# EAGLE design DigitMux (EAGLE 9.6.2)
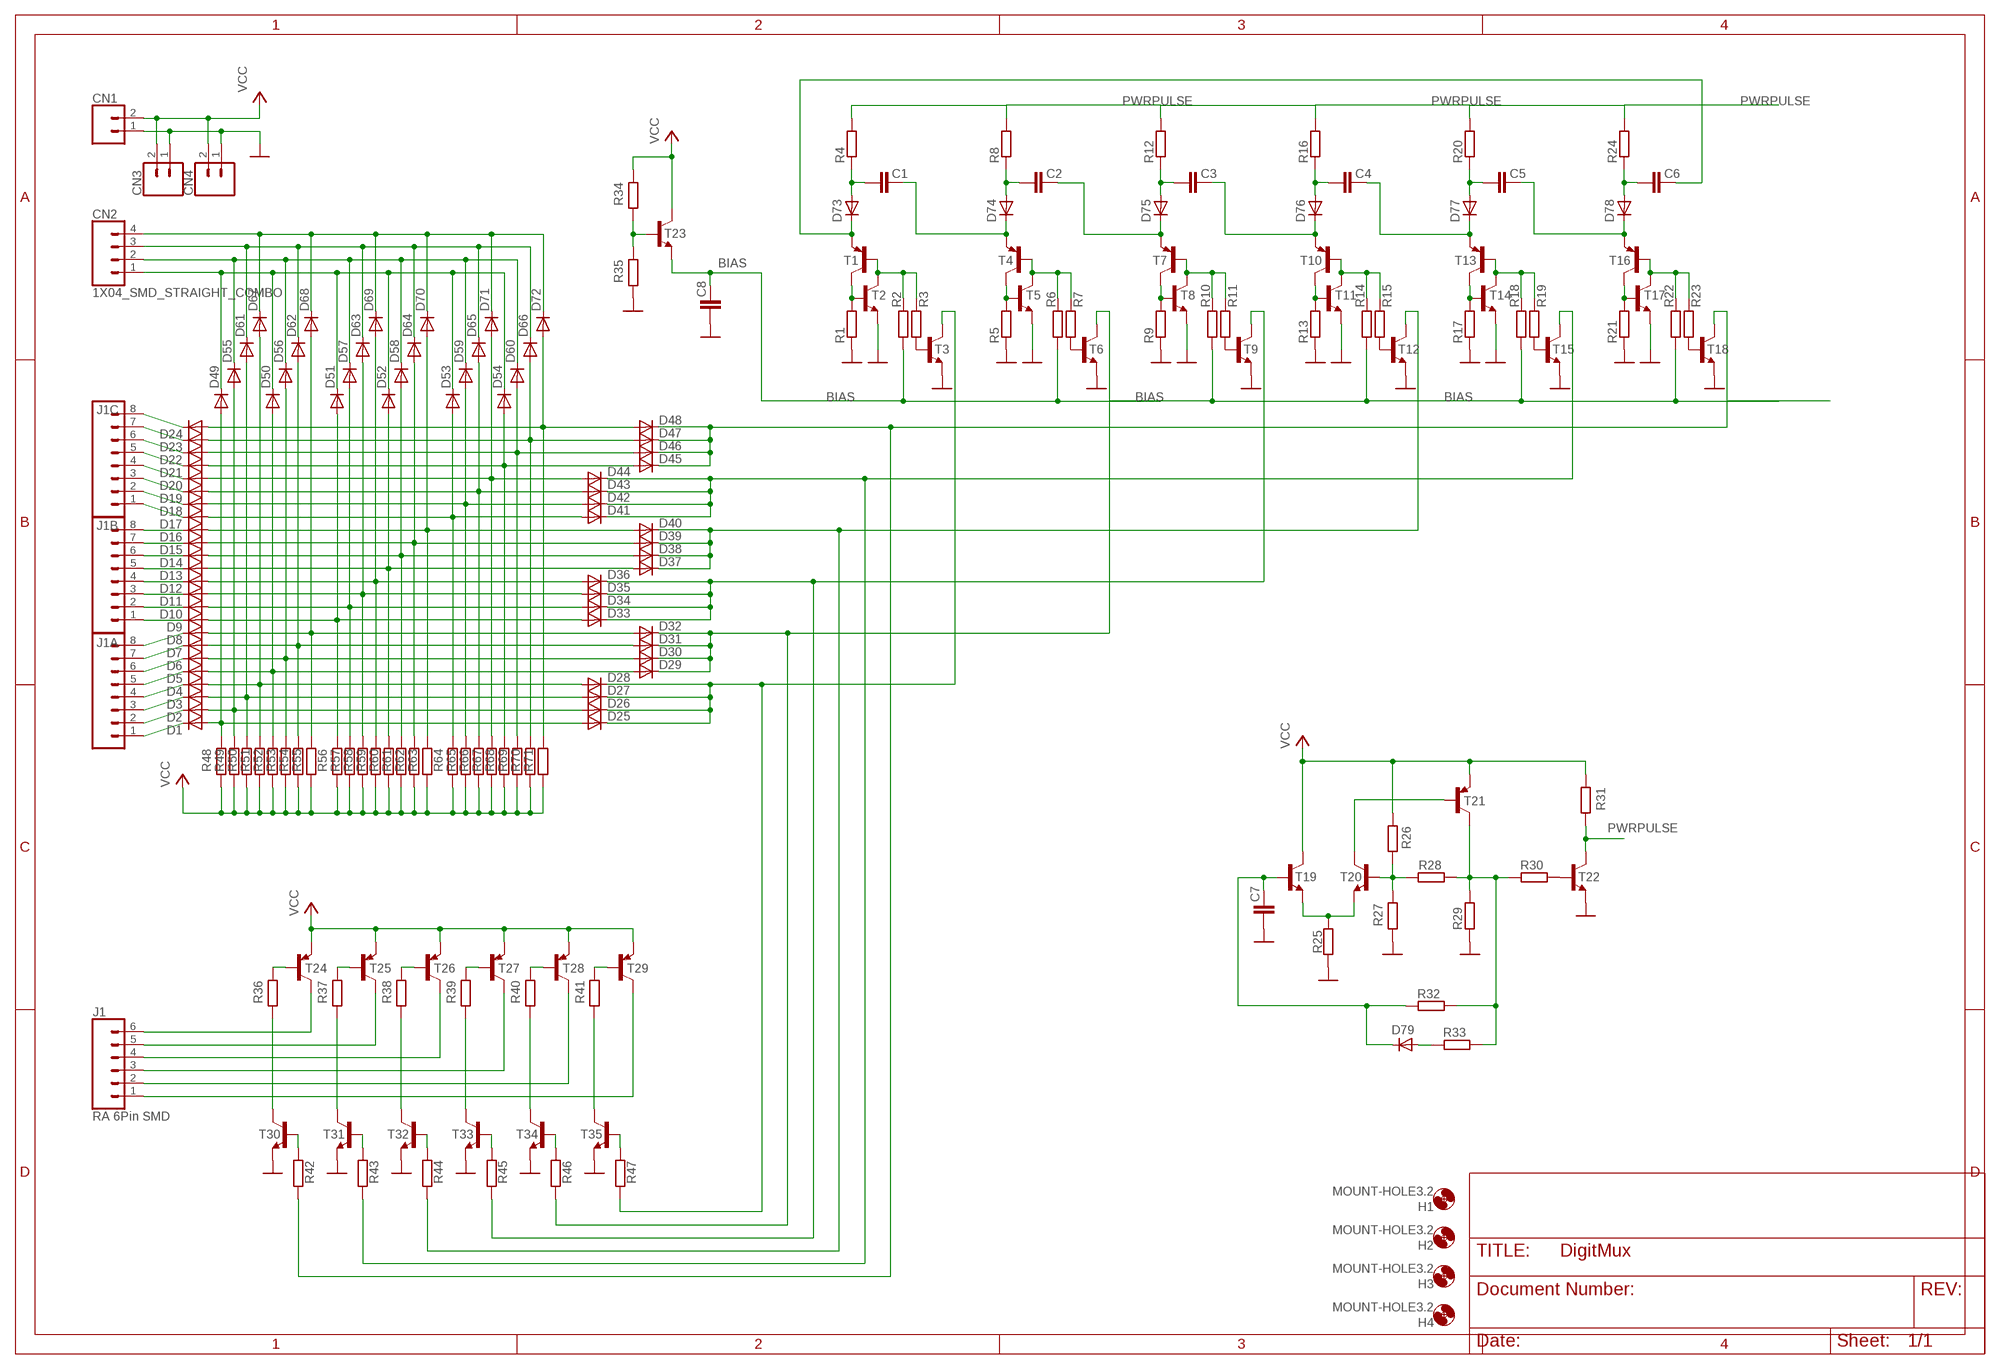
[diagram p0: schematic, sheet 1]

## Parts
C1  0.1uF  0.1UF-KIT-EZ-50V-20%  [CAP-PTH-SMALL-KIT]
C2  0.1uF  0.1UF-KIT-EZ-50V-20%  [CAP-PTH-SMALL-KIT]
C3  0.1uF  0.1UF-KIT-EZ-50V-20%  [CAP-PTH-SMALL-KIT]
C4  0.1uF  0.1UF-KIT-EZ-50V-20%  [CAP-PTH-SMALL-KIT]
C5  0.1uF  0.1UF-KIT-EZ-50V-20%  [CAP-PTH-SMALL-KIT]
C6  0.1uF  0.1UF-KIT-EZ-50V-20%  [CAP-PTH-SMALL-KIT]
C7  0.1uF  0.1UF-KIT-EZ-50V-20%  [CAP-PTH-SMALL-KIT]
C8  0.1uF  0.1UF-KIT-EZ-50V-20%  [CAP-PTH-SMALL-KIT]
CN1  CONN_02  [1X02]
CN2  1X04_SMD_STRAIGHT_COMBO  CONN_04  [1X04]
CN3  CONN_02  [1X02]
CN4  CONN_02  [1X02]
D1  SMALL_DIODEDO35-7  [DO35-7]
D2  SMALL_DIODEDO35-7  [DO35-7]
D3  SMALL_DIODEDO35-7  [DO35-7]
D4  SMALL_DIODEDO35-7  [DO35-7]
D5  SMALL_DIODEDO35-7  [DO35-7]
D6  SMALL_DIODEDO35-7  [DO35-7]
D7  SMALL_DIODEDO35-7  [DO35-7]
D8  SMALL_DIODEDO35-7  [DO35-7]
D9  SMALL_DIODEDO35-7  [DO35-7]
D10  SMALL_DIODEDO35-7  [DO35-7]
D11  SMALL_DIODEDO35-7  [DO35-7]
D12  SMALL_DIODEDO35-7  [DO35-7]
D13  SMALL_DIODEDO35-7  [DO35-7]
D14  SMALL_DIODEDO35-7  [DO35-7]
D15  SMALL_DIODEDO35-7  [DO35-7]
D16  SMALL_DIODEDO35-7  [DO35-7]
D17  SMALL_DIODEDO35-7  [DO35-7]
D18  SMALL_DIODEDO35-7  [DO35-7]
D19  SMALL_DIODEDO35-7  [DO35-7]
D20  SMALL_DIODEDO35-7  [DO35-7]
D21  SMALL_DIODEDO35-7  [DO35-7]
D22  SMALL_DIODEDO35-7  [DO35-7]
D23  SMALL_DIODEDO35-7  [DO35-7]
D24  SMALL_DIODEDO35-7  [DO35-7]
D25  SMALL_DIODEDO35-7  [DO35-7]
D26  SMALL_DIODEDO35-7  [DO35-7]
D27  SMALL_DIODEDO35-7  [DO35-7]
D28  SMALL_DIODEDO35-7  [DO35-7]
D29  SMALL_DIODEDO35-7  [DO35-7]
D30  SMALL_DIODEDO35-7  [DO35-7]
D31  SMALL_DIODEDO35-7  [DO35-7]
D32  SMALL_DIODEDO35-7  [DO35-7]
D33  SMALL_DIODEDO35-7  [DO35-7]
D34  SMALL_DIODEDO35-7  [DO35-7]
D35  SMALL_DIODEDO35-7  [DO35-7]
D36  SMALL_DIODEDO35-7  [DO35-7]
D37  SMALL_DIODEDO35-7  [DO35-7]
D38  SMALL_DIODEDO35-7  [DO35-7]
D39  SMALL_DIODEDO35-7  [DO35-7]
D40  SMALL_DIODEDO35-7  [DO35-7]
D41  SMALL_DIODEDO35-7  [DO35-7]
D42  SMALL_DIODEDO35-7  [DO35-7]
D43  SMALL_DIODEDO35-7  [DO35-7]
D44  SMALL_DIODEDO35-7  [DO35-7]
D45  SMALL_DIODEDO35-7  [DO35-7]
D46  SMALL_DIODEDO35-7  [DO35-7]
D47  SMALL_DIODEDO35-7  [DO35-7]
D48  SMALL_DIODEDO35-7  [DO35-7]
D49  SMALL_DIODEDO35-7  [DO35-7]
D50  SMALL_DIODEDO35-7  [DO35-7]
D51  SMALL_DIODEDO35-7  [DO35-7]
D52  SMALL_DIODEDO35-7  [DO35-7]
D53  SMALL_DIODEDO35-7  [DO35-7]
D54  SMALL_DIODEDO35-7  [DO35-7]
D55  SMALL_DIODEDO35-7  [DO35-7]
D56  SMALL_DIODEDO35-7  [DO35-7]
D57  SMALL_DIODEDO35-7  [DO35-7]
D58  SMALL_DIODEDO35-7  [DO35-7]
D59  SMALL_DIODEDO35-7  [DO35-7]
D60  SMALL_DIODEDO35-7  [DO35-7]
D61  SMALL_DIODEDO35-7  [DO35-7]
D62  SMALL_DIODEDO35-7  [DO35-7]
D63  SMALL_DIODEDO35-7  [DO35-7]
D64  SMALL_DIODEDO35-7  [DO35-7]
D65  SMALL_DIODEDO35-7  [DO35-7]
D66  SMALL_DIODEDO35-7  [DO35-7]
D67  SMALL_DIODEDO35-7  [DO35-7]
D68  SMALL_DIODEDO35-7  [DO35-7]
D69  SMALL_DIODEDO35-7  [DO35-7]
D70  SMALL_DIODEDO35-7  [DO35-7]
D71  SMALL_DIODEDO35-7  [DO35-7]
D72  SMALL_DIODEDO35-7  [DO35-7]
D73  SMALL_DIODEDO35-7  [DO35-7]
D74  SMALL_DIODEDO35-7  [DO35-7]
D75  SMALL_DIODEDO35-7  [DO35-7]
D76  SMALL_DIODEDO35-7  [DO35-7]
D77  SMALL_DIODEDO35-7  [DO35-7]
D78  SMALL_DIODEDO35-7  [DO35-7]
D79  SMALL_DIODEDO35-7  [DO35-7]
H1  MOUNT-HOLE3.2  [3,2]
H2  MOUNT-HOLE3.2  [3,2]
H3  MOUNT-HOLE3.2  [3,2]
H4  MOUNT-HOLE3.2  [3,2]
J1  RA 6Pin SMD  CONN_06SILK_FEMALE_PTH  [1X06]
J1A  CONN_08"  [1X08]
J1B  CONN_08"  [1X08]
J1C  CONN_08"  [1X08]
R1  RESISTOR7MM  [7MM_RESISTOR]
R2  RESISTOR7MM  [7MM_RESISTOR]
R3  RESISTOR7MM  [7MM_RESISTOR]
R4  RESISTOR7MM  [7MM_RESISTOR]
R5  RESISTOR7MM  [7MM_RESISTOR]
R6  RESISTOR7MM  [7MM_RESISTOR]
R7  RESISTOR7MM  [7MM_RESISTOR]
R8  RESISTOR7MM  [7MM_RESISTOR]
R9  RESISTOR7MM  [7MM_RESISTOR]
R10  RESISTOR7MM  [7MM_RESISTOR]
R11  RESISTOR7MM  [7MM_RESISTOR]
R12  RESISTOR7MM  [7MM_RESISTOR]
R13  RESISTOR7MM  [7MM_RESISTOR]
R14  RESISTOR7MM  [7MM_RESISTOR]
R15  RESISTOR7MM  [7MM_RESISTOR]
R16  RESISTOR7MM  [7MM_RESISTOR]
R17  RESISTOR7MM  [7MM_RESISTOR]
R18  RESISTOR7MM  [7MM_RESISTOR]
R19  RESISTOR7MM  [7MM_RESISTOR]
R20  RESISTOR7MM  [7MM_RESISTOR]
R21  RESISTOR7MM  [7MM_RESISTOR]
R22  RESISTOR7MM  [7MM_RESISTOR]
R23  RESISTOR7MM  [7MM_RESISTOR]
R24  RESISTOR7MM  [7MM_RESISTOR]
R25  RESISTOR7MM  [7MM_RESISTOR]
R26  RESISTOR7MM  [7MM_RESISTOR]
R27  RESISTOR7MM  [7MM_RESISTOR]
R28  RESISTOR7MM  [7MM_RESISTOR]
R29  RESISTOR7MM  [7MM_RESISTOR]
R30  RESISTOR7MM  [7MM_RESISTOR]
R31  RESISTOR7MM  [7MM_RESISTOR]
R32  RESISTOR7MM  [7MM_RESISTOR]
R33  RESISTOR7MM  [7MM_RESISTOR]
R34  RESISTOR7MM  [7MM_RESISTOR]
R35  RESISTOR7MM  [7MM_RESISTOR]
R36  RESISTOR7MM  [7MM_RESISTOR]
R37  RESISTOR7MM  [7MM_RESISTOR]
R38  RESISTOR7MM  [7MM_RESISTOR]
R39  RESISTOR7MM  [7MM_RESISTOR]
R40  RESISTOR7MM  [7MM_RESISTOR]
R41  RESISTOR7MM  [7MM_RESISTOR]
R42  RESISTOR7MM  [7MM_RESISTOR]
R43  RESISTOR7MM  [7MM_RESISTOR]
R44  RESISTOR7MM  [7MM_RESISTOR]
R45  RESISTOR7MM  [7MM_RESISTOR]
R46  RESISTOR7MM  [7MM_RESISTOR]
R47  RESISTOR7MM  [7MM_RESISTOR]
R48  RESISTOR7MM  [7MM_RESISTOR]
R49  RESISTOR7MM  [7MM_RESISTOR]
R50  RESISTOR7MM  [7MM_RESISTOR]
R51  RESISTOR7MM  [7MM_RESISTOR]
R52  RESISTOR7MM  [7MM_RESISTOR]
R53  RESISTOR7MM  [7MM_RESISTOR]
R54  RESISTOR7MM  [7MM_RESISTOR]
R55  RESISTOR7MM  [7MM_RESISTOR]
R56  RESISTOR7MM  [7MM_RESISTOR]
R57  RESISTOR7MM  [7MM_RESISTOR]
R58  RESISTOR7MM  [7MM_RESISTOR]
R59  RESISTOR7MM  [7MM_RESISTOR]
R60  RESISTOR7MM  [7MM_RESISTOR]
R61  RESISTOR7MM  [7MM_RESISTOR]
R62  RESISTOR7MM  [7MM_RESISTOR]
R63  RESISTOR7MM  [7MM_RESISTOR]
R64  RESISTOR7MM  [7MM_RESISTOR]
R65  RESISTOR7MM  [7MM_RESISTOR]
R66  RESISTOR7MM  [7MM_RESISTOR]
R67  RESISTOR7MM  [7MM_RESISTOR]
R68  RESISTOR7MM  [7MM_RESISTOR]
R69  RESISTOR7MM  [7MM_RESISTOR]
R70  RESISTOR7MM  [7MM_RESISTOR]
R71  RESISTOR7MM  [7MM_RESISTOR]
T1  BC557B-PNP-TO92-EBC  [TO92-EBC]
T2  BC547B-NPN-TO92-CBE  [TO92-CBE]
T3  BC547B-NPN-TO92-CBE  [TO92-CBE]
T4  BC557B-PNP-TO92-EBC  [TO92-EBC]
T5  BC547B-NPN-TO92-CBE  [TO92-CBE]
T6  BC547B-NPN-TO92-CBE  [TO92-CBE]
T7  BC557B-PNP-TO92-EBC  [TO92-EBC]
T8  BC547B-NPN-TO92-CBE  [TO92-CBE]
T9  BC547B-NPN-TO92-CBE  [TO92-CBE]
T10  BC557B-PNP-TO92-EBC  [TO92-EBC]
T11  BC547B-NPN-TO92-CBE  [TO92-CBE]
T12  BC547B-NPN-TO92-CBE  [TO92-CBE]
T13  BC557B-PNP-TO92-EBC  [TO92-EBC]
T14  BC547B-NPN-TO92-CBE  [TO92-CBE]
T15  BC547B-NPN-TO92-CBE  [TO92-CBE]
T16  BC557B-PNP-TO92-EBC  [TO92-EBC]
T17  BC547B-NPN-TO92-CBE  [TO92-CBE]
T18  BC547B-NPN-TO92-CBE  [TO92-CBE]
T19  BC547B-NPN-TO92-CBE  [TO92-CBE]
T20  BC547B-NPN-TO92-CBE  [TO92-CBE]
T21  BC557B-PNP-TO92-EBC  [TO92-EBC]
T22  BC547B-NPN-TO92-CBE  [TO92-CBE]
T23  BC547B-NPN-TO92-CBE  [TO92-CBE]
T24  BC557B-PNP-TO92-EBC  [TO92-EBC]
T25  BC557B-PNP-TO92-EBC  [TO92-EBC]
T26  BC557B-PNP-TO92-EBC  [TO92-EBC]
T27  BC557B-PNP-TO92-EBC  [TO92-EBC]
T28  BC557B-PNP-TO92-EBC  [TO92-EBC]
T29  BC557B-PNP-TO92-EBC  [TO92-EBC]
T30  BC547B-NPN-TO92-CBE  [TO92-CBE]
T31  BC547B-NPN-TO92-CBE  [TO92-CBE]
T32  BC547B-NPN-TO92-CBE  [TO92-CBE]
T33  BC547B-NPN-TO92-CBE  [TO92-CBE]
T34  BC547B-NPN-TO92-CBE  [TO92-CBE]
T35  BC547B-NPN-TO92-CBE  [TO92-CBE]

## Nets
BIAS: C8.2 R2.1 R6.1 R10.1 R14.1 R18.1 R22.1 T23.E
GND [PWR]: C7.1 C8.1 CN1.1 CN3.1 CN4.1 R1.1 R5.1 R9.1 R13.1 R17.1 R21.1 R25.1 R27.1 R29.2 R35.1 T2.E T3.E T5.E T6.E T8.E T9.E T11.E T12.E T14.E T15.E T17.E T18.E T22.E T30.E T31.E T32.E T33.E T34.E T35.E
N$1: R3.1 T3.B
N$2: D1.C J1A.1
N$3: R1.2 T1.C T2.B
N$4: C6.2 D73.C T1.E
N$5: D37.C D38.C D39.C D40.C R44.1 T12.C
N$6: D2.C J1A.2
N$7: D3.C J1A.3
N$8: D4.C J1A.4
N$9: D5.C J1A.5
N$10: D6.C J1A.6
N$11: D7.C J1A.7
N$12: D8.C J1A.8
N$13: D9.C J1B.1
N$14: D10.C J1B.2
N$15: D11.C J1B.3
N$16: D12.C J1B.4
N$17: D13.C J1B.5
N$18: D14.C J1B.6
N$19: D15.C J1B.7
N$20: D16.C J1B.8
N$21: D17.C J1C.1
N$22: D18.C J1C.2
N$23: D19.C J1C.3
N$24: D20.C J1C.4
N$25: D21.C J1C.5
N$26: D22.C J1C.6
N$27: D23.C J1C.7
N$28: D24.C J1C.8
N$29: D1.A D25.A D49.A R48.2
N$30: D17.A D41.A D53.A R64.2
N$31: D2.A D26.A D55.A R49.2
N$32: D3.A D27.A D61.A R50.2
N$33: D4.A D28.A D67.A R51.2
N$34: D5.A D29.A D50.A R52.2
N$35: D6.A D30.A D56.A R53.2
N$36: D7.A D31.A D62.A R54.2
N$37: D8.A D32.A D68.A R55.2
N$38: D9.A D33.A D51.A R56.2
N$39: D10.A D34.A D57.A R57.2
N$40: D11.A D35.A D63.A R58.2
N$41: D12.A D36.A D69.A R59.2
N$42: D13.A D37.A D52.A R60.2
N$43: D14.A D38.A D58.A R61.2
N$44: D15.A D39.A D64.A R62.2
N$45: D16.A D40.A D70.A R63.2
N$46: D18.A D42.A D59.A R65.2
N$47: D19.A D43.A D65.A R66.2
N$48: D20.A D44.A D71.A R67.2
N$49: D21.A D45.A D54.A R68.2
N$50: D22.A D46.A D60.A R69.2
N$51: D23.A D47.A D66.A R70.2
N$52: D24.A D48.A D72.A R71.2
N$53: R34.1 R35.2 T23.B
N$54: R28.1 R29.1 R30.2 R32.1 R33.1 T21.C
N$55: R11.1 T9.B
N$56: D33.C D34.C D35.C D36.C R45.1 T9.C
N$57: T20.C T21.B
N$58: D41.C D42.C D43.C D44.C R43.1 T15.C
N$59: R2.2 R3.2 T1.B T2.C
N$60: CN2.1 D49.C D50.C D51.C D52.C D53.C D54.C
N$61: CN2.2 D55.C D56.C D57.C D58.C D59.C D60.C
N$62: CN2.3 D61.C D62.C D63.C D64.C D65.C D66.C
N$63: CN2.4 D67.C D68.C D69.C D70.C D71.C D72.C
N$64: C1.1 D73.A R4.1
N$65: R7.1 T6.B
N$66: R5.2 T4.C T5.B
N$67: C1.2 D74.C T4.E
N$68: R25.2 T19.E T20.E
N$69: R9.2 T7.C T8.B
N$70: C2.1 D74.A R8.1
N$71: C2.2 D75.C T7.E
N$72: R19.1 T15.B
N$73: R6.2 R7.2 T4.B T5.C
N$74: C3.1 D75.A R12.1
N$75: R15.1 T12.B
N$76: R13.2 T10.C T11.B
N$77: R17.2 T13.C T14.B
N$78: R26.1 R27.2 R28.2 T20.B
N$79: C4.1 D76.A R16.1
N$80: C4.2 D77.C T13.E
N$81: C3.2 D76.C T10.E
N$82: R10.2 R11.2 T7.B T8.C
N$83: R30.1 T22.B
N$84: C5.1 D77.A R20.1
N$85: R23.1 T18.B
N$86: R21.2 T16.C T17.B
N$87: C5.2 D78.C T16.E
N$88: J1.6 T24.C
N$89: C6.1 D78.A R24.1
N$90: D79.A R33.2
N$91: C7.2 D79.C R32.2 T19.B
N$92: J1.5 T25.C
N$93: J1.4 T26.C
N$94: J1.3 T27.C
N$95: J1.2 T28.C
N$96: J1.1 T29.C
N$97: R36.2 T24.B
N$98: R37.2 T25.B
N$99: R38.2 T26.B
N$100: R39.2 T27.B
N$101: R40.2 T28.B
N$102: R41.2 T29.B
N$103: R36.1 T30.C
N$104: R37.1 T31.C
N$105: R38.1 T32.C
N$106: R39.1 T33.C
N$107: R40.1 T34.C
N$108: R41.1 T35.C
N$109: D45.C D46.C D47.C D48.C R42.1 T18.C
N$110: R42.2 T30.B
N$111: R14.2 R15.2 T10.B T11.C
N$112: R43.2 T31.B
N$113: R18.2 R19.2 T13.B T14.C
N$114: R44.2 T32.B
N$115: R22.2 R23.2 T16.B T17.C
N$116: R45.2 T33.B
N$117: D29.C D30.C D31.C D32.C R46.1 T6.C
N$118: R46.2 T34.B
N$119: D25.C D26.C D27.C D28.C R47.1 T3.C
N$120: R47.2 T35.B
PWRPULSE: R4.2 R8.2 R12.2 R16.2 R20.2 R24.2 R31.1 T22.C
VCC [PWR]: CN1.2 CN3.2 CN4.2 R26.2 R31.2 R34.2 R48.1 R49.1 R50.1 R51.1 R52.1 R53.1 R54.1 R55.1 R56.1 R57.1 R58.1 R59.1 R60.1 R61.1 R62.1 R63.1 R64.1 R65.1 R66.1 R67.1 R68.1 R69.1 R70.1 R71.1 T19.C T21.E T23.C T24.E T25.E T26.E T27.E T28.E T29.E

## Library data of the parts
C1-C8 = MatsEng:0.1UF: 0.1µF ceramic capacitors A capacitor is a passive two-terminal electrical component used to store electrical energy temporarily in an electric field.; PROD_ID: CAP-08370
CN1 CN3 CN4 = MatsEng:CONN_02: Multi connection point. Often used as Generic Header-pin footprint for 0.1 inch spaced/style header connections On any of the 0.1 inch spaced packages, you can populate with these: Break Away Headers - Straight <https://www.sparkfun.com/products/116> (PRT-00116) Break Away Male Headers - Right Angle <https://www.sparkfun.com/products/553> (PRT-00553) Female Headers <https://www.sparkfun.com/products/115> (PRT-00115) Break Away Headers - Machine Pin <https://www.sparkfun.com/products/117> (PRT-00117) Break Away Female Headers - Swiss Machine Pin <https://www.sparkfun.com/products/743> (PRT-00743) For SCREWTERMINALS and SPRING TERMINALS visit here: Screw Terimnals on SparkFun.com <https://www.sparkfun.com/search/results?term=Screw+Terminals> (5mm/3.5mm/2.54mm spacing) This device is also useful as a general connection point to wire up your design to another part of your project. Our various solder wires solder well into these plated through hole pads. Hook-Up Wire - Assortment (Stranded, 22 AWG) <https://www.sparkfun.com/products/11375> (PRT-11375) Hook-Up Wire - Assortment (Solid Core, 22 AWG) <https://www.sparkfun.com/products/11367> (PRT-11367) View the entire wire category on our website here <https://www.sparkfun.com/categories/141> Special notes: Molex polarized connector foot print use with: PRT-08233 with associated crimp pins and housings. 2.54_SCREWTERM for use with PRT-10571. 3.5mm Screw Terminal footprints for PRT-08084 5mm Screw Terminal footprints for use with PRT-08432; PROD_ID: CONN-13512; SF_ID: PRT-09918; SF_SKU: PRT-08432; SKU: PRT-09914
CN2 = MatsEng:CONN_04: Multi connection point. Often used as Generic Header-pin footprint for 0.1 inch spaced/style header connections On any of the 0.1 inch spaced packages, you can populate with these: Break Away Headers - Straight <https://www.sparkfun.com/products/116> (PRT-00116) Break Away Male Headers - Right Angle <https://www.sparkfun.com/products/553> (PRT-00553) Female Headers <https://www.sparkfun.com/products/115> (PRT-00115) Break Away Headers - Machine Pin <https://www.sparkfun.com/products/117> (PRT-00117) Break Away Female Headers - Swiss Machine Pin <https://www.sparkfun.com/products/743> (PRT-00743) For SCREWTERMINALS and SPRING TERMINALS visit here: Screw Terimnals on SparkFun.com <https://www.sparkfun.com/search/results?term=Screw+Terminals> (5mm/3.5mm/2.54mm spacing) This device is also useful as a general connection point to wire up your design to another part of your project. Our various solder wires solder well into these plated through hole pads. Hook-Up Wire - Assortment (Stranded, 22 AWG) <https://www.sparkfun.com/products/11375> (PRT-11375) Hook-Up Wire - Assortment (Solid Core, 22 AWG) <https://www.sparkfun.com/products/11367> (PRT-11367) View the entire wire category on our website here <https://www.sparkfun.com/categories/141> Special notes: Molex polarized connector foot print use with SKU : PRT-08231 with associated crimp pins and housings. 1MM SMD Version SKU: PRT-10208; PROD_ID: CONN-08511; SF_ID: PRT-12638
D1-D79 = MatsEng:SMALL_DIODE: Small Signal Diode
H1-H4 = MatsEng:MOUNT-HOLE: MOUNTING HOLE with drill center marker
J1 = MatsEng:CONN_06: Multi connection point. Often used as Generic Header-pin footprint for 0.1 inch spaced/style header connections On any of the 0.1 inch spaced packages, you can populate with these: Break Away Headers - Straight <https://www.sparkfun.com/products/116> (PRT-00116) Break Away Male Headers - Right Angle <https://www.sparkfun.com/products/553> (PRT-00553) Female Headers <https://www.sparkfun.com/products/115> (PRT-00115) Break Away Headers - Machine Pin <https://www.sparkfun.com/products/117> (PRT-00117) Break Away Female Headers - Swiss Machine Pin <https://www.sparkfun.com/products/743> (PRT-00743) Arduino Stackable Header - 6 Pin <https://www.sparkfun.com/products/9280> (PRT-09280) For SCREWTERMINALS and SPRING TERMINALS visit here: Screw Terimnals on SparkFun.com <https://www.sparkfun.com/search/results?term=Screw+Terminals> (5mm/3.5mm/2.54mm spacing) This device is also useful as a general connection point to wire up your design to another part of your project. Our various solder wires solder well into these plated through hole pads. Hook-Up Wire - Assortment (Stranded, 22 AWG) <https://www.sparkfun.com/products/11375> (PRT-11375) Hook-Up Wire - Assortment (Solid Core, 22 AWG) <https://www.sparkfun.com/products/11367> (PRT-11367) View the entire wire category on our website here <https://www.sparkfun.com/categories/141>; PROD_ID: CONN-11293; SF_ID: GPS-00579
J1A J1B J1C = MatsEng:CONN_08: Multi connection point. Often used as Generic Header-pin footprint for 0.1 inch spaced/style header connections On any of the 0.1 inch spaced packages, you can populate with these: Break Away Headers - Straight <https://www.sparkfun.com/products/116> (PRT-00116) Break Away Male Headers - Right Angle <https://www.sparkfun.com/products/553> (PRT-00553) Female Headers <https://www.sparkfun.com/products/115> (PRT-00115) Break Away Headers - Machine Pin <https://www.sparkfun.com/products/117> (PRT-00117) Break Away Female Headers - Swiss Machine Pin <https://www.sparkfun.com/products/743> (PRT-00743) Arduino Stackable Header - 8 Pin <https://www.sparkfun.com/products/9279> (PRT-09279) For SCREWTERMINALS and SPRING TERMINALS visit here: Screw Terimnals on SparkFun.com <https://www.sparkfun.com/search/results?term=Screw+Terminals> (5mm/3.5mm/2.54mm spacing) This device is also useful as a general connection point to wire up your design to another part of your project. Our various solder wires solder well into these plated through hole pads. Hook-Up Wire - Assortment (Stranded, 22 AWG) <https://www.sparkfun.com/products/11375> (PRT-11375) Hook-Up Wire - Assortment (Solid Core, 22 AWG) <https://www.sparkfun.com/products/11367> (PRT-11367) View the entire wire category on our website here <https://www.sparkfun.com/categories/141> Special notes: Molex polarized connector foot print use with SKU : PRT-08231 with associated crimp pins and housings. 1MM SMD Version SKU: PRT-10208 NOTES ON THE VARIANTS LOCK and LOCK_LONGPADS... This footprint was designed to help hold the alignment of a through-hole component (i.e. 6-pin header) while soldering it into place. You may notice that each hole has been shifted either up or down by 0.005 of an inch from it's more standard position (which is a perfectly straight line). This slight alteration caused the pins (the squares in the middle) to touch the edges of the holes. Because they are alternating, it causes a "brace" to hold the component in place. 0.005 has proven to be the perfect amount of "off-center" position when using our standard breakaway headers. Although looks a little odd when you look at the bare footprint, once you have a header in there, the alteration is very hard to notice. Also,if you push a header all the way into place, it is covered up entirely on the bottom side.; PROD_ID: CONN-10204; SF_ID: PRT-11543
R1-R71 = MatsEng:RESISTOR: Standard resistor, various versions
T1 T4 T7 T10 T13 T16 T21 T24-T29 = MatsEng:*-PNP-: PNP Transistror
T2 T3 T5 T6 T8 T9 T11 T12 T14 T15 T17-T20 T22 T23 T30-T35 = MatsEng:*-NPN-: NPN Transistror BF959 corrected 2008.03.06

## Net classes
0 default: width 0.305 mm, drill 0.4 mm, clearance 0.203 mm
1 PWR: width 0.61 mm, drill 0.4 mm, clearance 0.203 mm

## Board
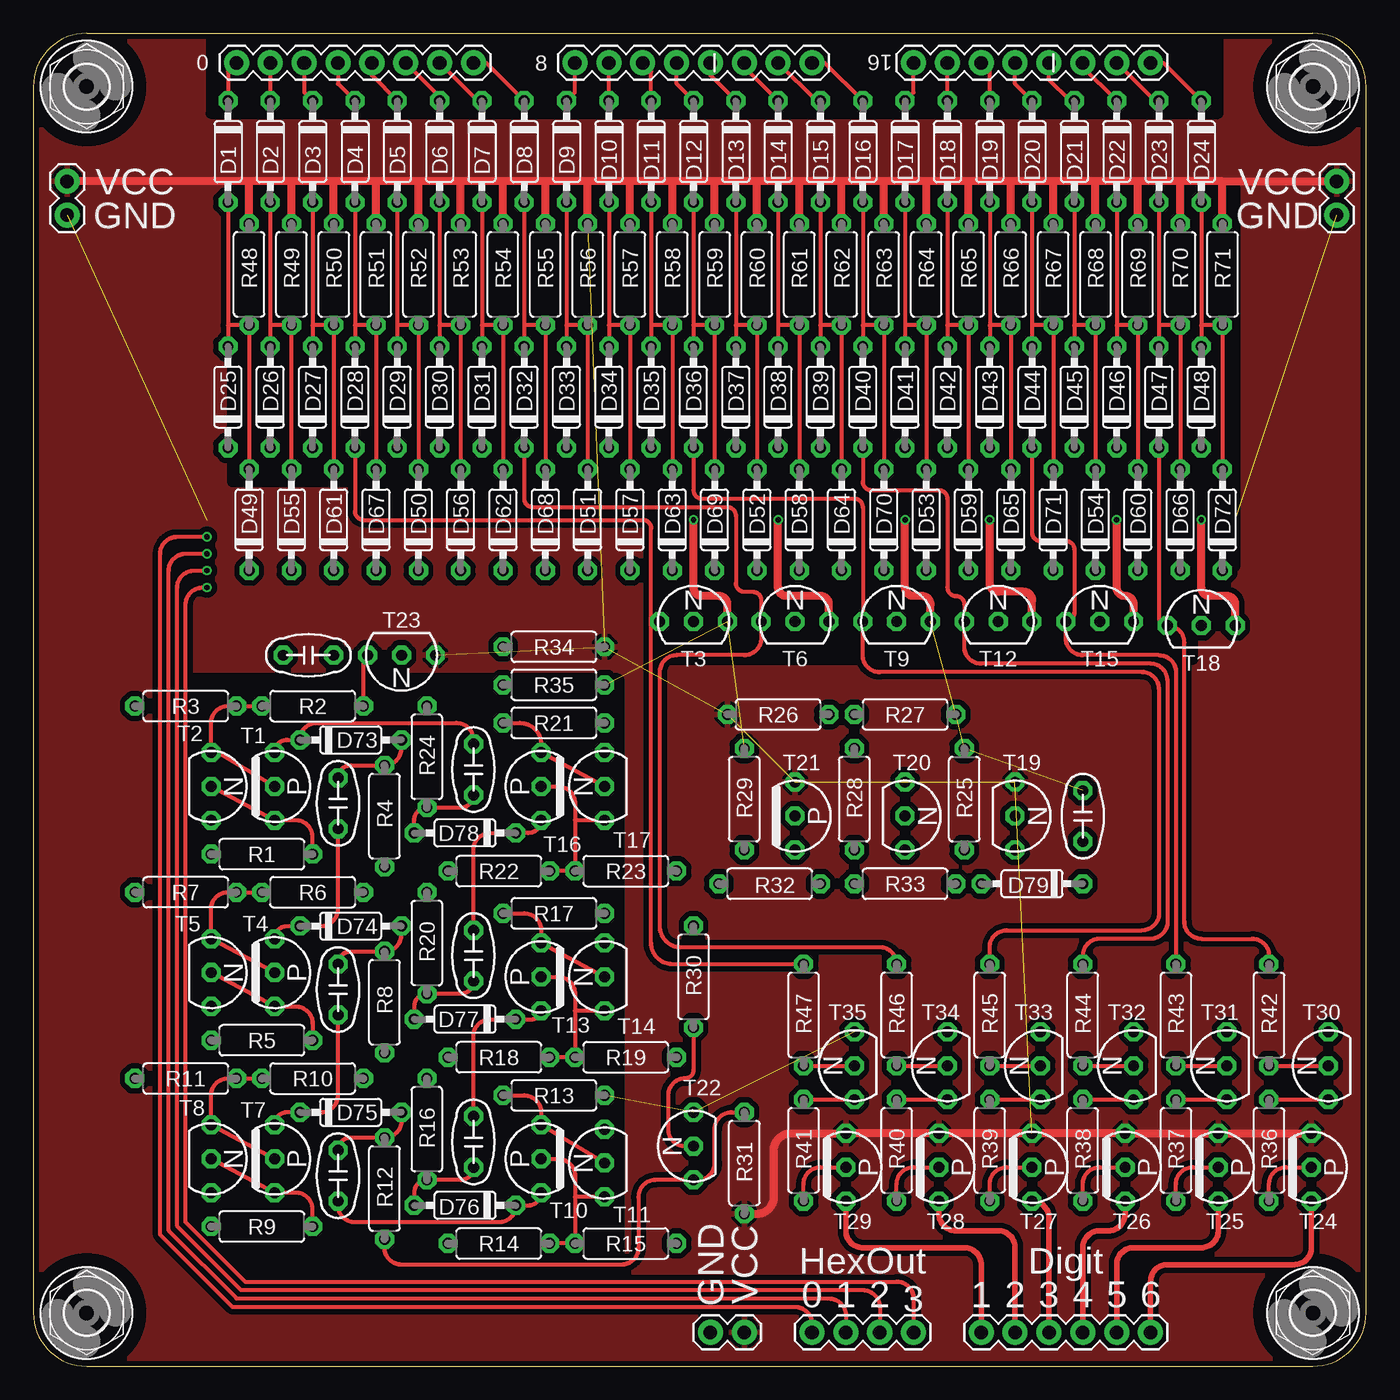
[diagram p1: board, top side]
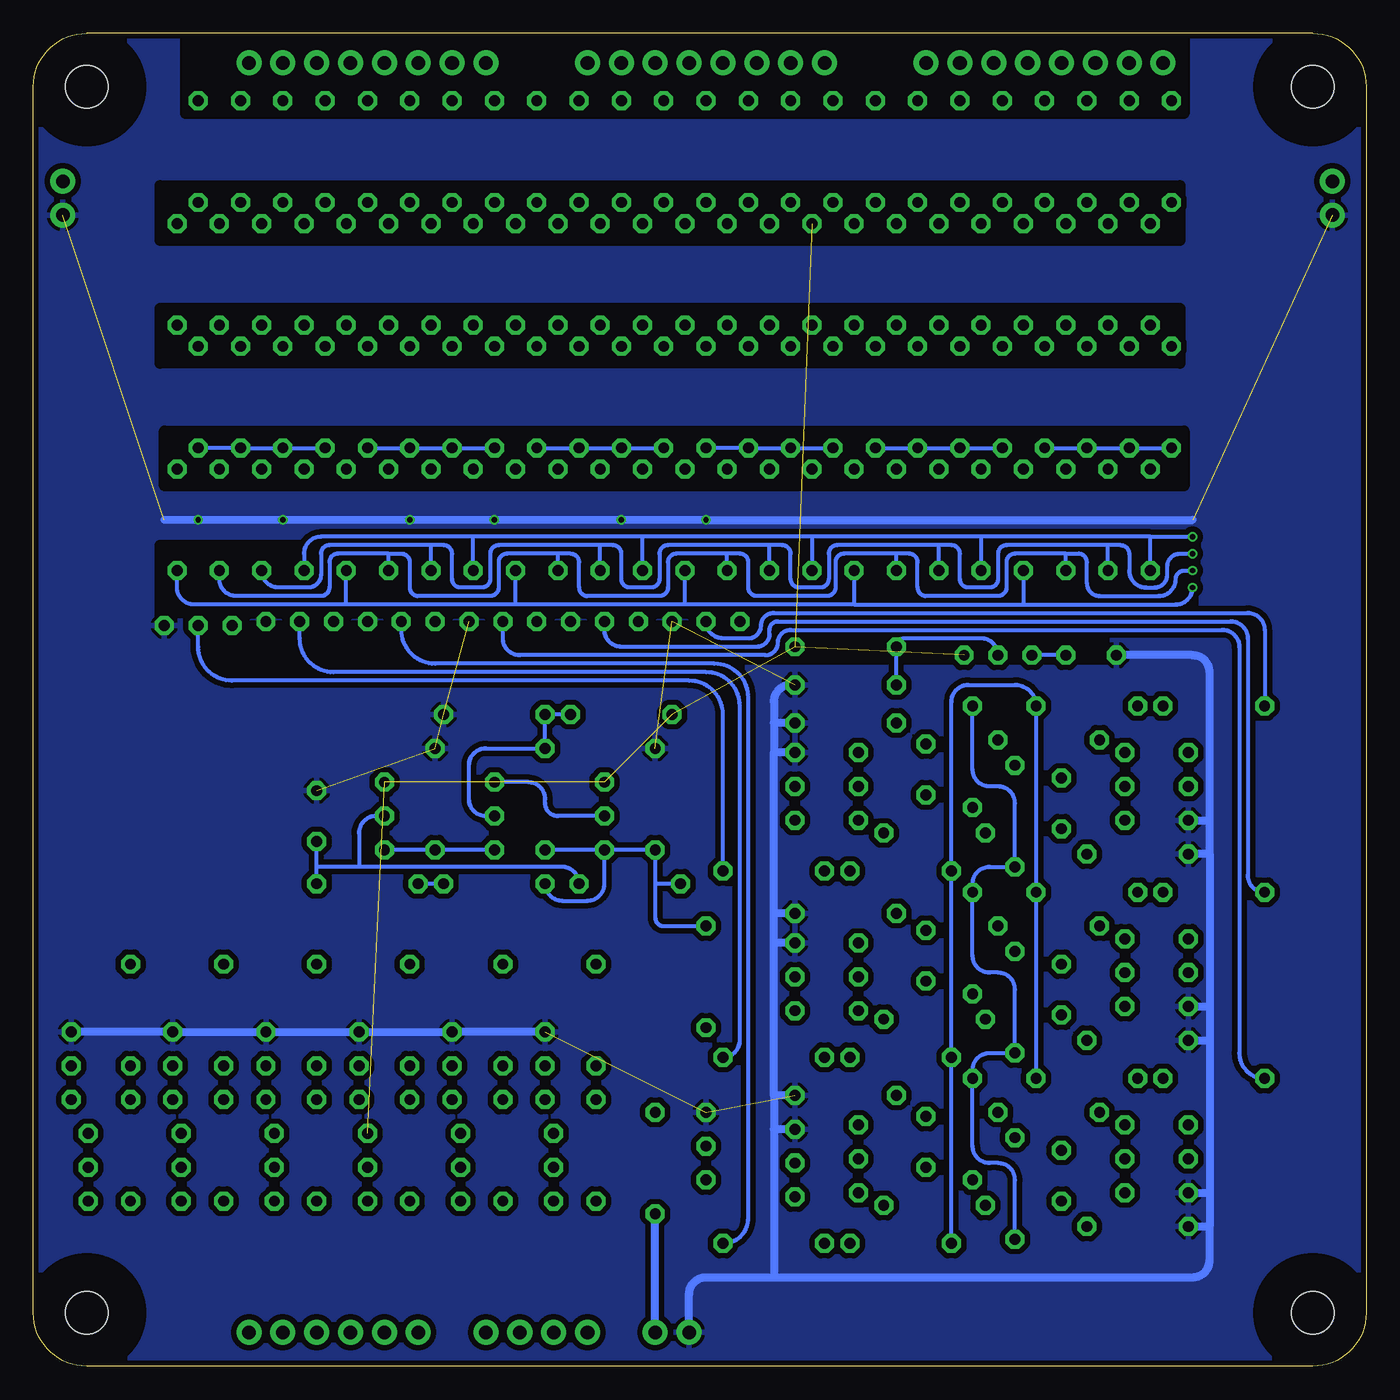
[diagram p2: board, bottom side, seen from below]

Size 100 x 100 mm. Coordinates in mm from the lower left corner, seen from the top.
Outline: 4,0 96,0 arc90 100,4 100,96 arc90 96,100 4,100 arc90 0,96 0,4 arc90 4,0
Copper layers (1*16): Top 0.035mm / dielectric 1.5mm / Bottom 0.035mm
Design rules "dirt_cheap_dirty_boards.v1.1": minimum track width 6mil, minimum drill 12mil, track to track 6mil, track to pad 6mil, pad to pad 6mil, via to via 6mil, smd to smd 0mil, copper to edge 10mil, drill to drill 10mil, minimum pad ring 10mil, minimum via ring 6mil, stop-mask expansion 2mil, vias tented up to drill 25mil, thermal gap 10mil
tRestrict: area 14.9,66.4 to 90.2,88.4; area 42.2,50.2 to 43.2,51.1; area 12.1,6.7 to 43.8,51.4; area 84.8,60 to 90.2,66.4; area 13.3,94 to 88.9,100; area 47,53 to 87,58.4
bRestrict: area 13,56.5 to 90.5,61.6; area 19.7,53 to 87.3,55.6; area 13.7,66 to 90.2,70.2; area 14,75.2 to 90.5,79.4; area 14,84.5 to 90.5,88.6; area 13.7,94 to 88.6,100

### Footprints (pad centres in the part's own frame; a part is rotated, then mirrored left to right if it is on the bottom)
CAP-PTH-SMALL-KIT = drill 0.813 pad 1.422 octagon: 1 -1.905,0; 2 1.905,0
1X02 = drill 1.016 pad 1.88: 1 0,0; 2 2.54,0
1X04 = drill 1.016 pad 1.88: 1 0,0; 2 2.54,0; 3 5.08,0; 4 7.62,0
DO35-7 = drill 0.813 pad 1.422 octagon: A 3.81,0; C -3.81,0
3,2 = hole 3.2: 0,0
1X06 = drill 1.016 pad 1.88: 1 0,0; 2 2.54,0; 3 5.08,0; 4 7.62,0; 5 10.16,0; 6 12.7,0
1X08 = drill 1.016 pad 1.88: 1 0,0; 2 2.54,0; 3 5.08,0; 4 7.62,0; 5 10.16,0; 6 12.7,0; 7 15.24,0; 8 17.78,0
7MM_RESISTOR = drill 0.813 pad 1.422 octagon: 1 -3.81,0; 2 3.81,0
TO92-EBC = drill 0.813 pad 1.422 octagon: B 0,-1.27; C 2.54,-1.27; E -2.54,-1.27
TO92-CBE = drill 0.813 pad 1.422 octagon: B 0,0; C -2.54,0; E 2.54,0

### Placement (x,y rotation side)
C1  22.86,42.23 270 top
C2  22.86,28.26 270 top
C3  22.86,14.29 270 top
C4  33.02,16.83 90 top
C5  33.02,30.8 90 top
C6  33.02,44.77 90 top
C7  78.74,41.27 270 top
C8  20.64,53.34 0 top
CN1  50.8,2.54 0 top
CN2  58.42,2.54 0 top
CN3  2.54,86.36 90 top
CN4  97.79,86.36 90 top
D1  14.61,91.12 270 top
D2  17.78,91.12 270 top
D3  20.95,91.12 270 top
D4  24.13,91.12 270 top
D5  27.3,91.12 270 top
D6  30.48,91.12 270 top
D7  33.66,91.12 270 top
D8  36.83,91.12 270 top
D9  40.01,91.12 270 top
D10  43.18,91.12 270 top
D11  46.35,91.12 270 top
D12  49.53,91.12 270 top
D13  52.7,91.12 270 top
D14  55.88,91.12 270 top
D15  59.05,91.12 270 top
D16  62.23,91.12 270 top
D17  65.41,91.12 270 top
D18  68.58,91.12 270 top
D19  71.75,91.12 270 top
D20  74.93,91.12 270 top
D21  78.11,91.12 270 top
D22  81.28,91.12 270 top
D23  84.45,91.12 270 top
D24  87.63,91.12 270 top
D25  14.61,72.71 90 top
D26  17.78,72.71 90 top
D27  20.95,72.71 90 top
D28  24.13,72.71 90 top
D29  27.3,72.71 90 top
D30  30.48,72.71 90 top
D31  33.66,72.71 90 top
D32  36.83,72.71 90 top
D33  40.01,72.71 90 top
D34  43.18,72.71 90 top
D35  46.35,72.71 90 top
D36  49.53,72.71 90 top
D37  52.7,72.71 90 top
D38  55.88,72.71 90 top
D39  59.05,72.71 90 top
D40  62.23,72.71 90 top
D41  65.41,72.71 90 top
D42  68.58,72.71 90 top
D43  71.75,72.71 90 top
D44  74.93,72.71 90 top
D45  78.11,72.71 90 top
D46  81.28,72.71 90 top
D47  84.45,72.71 90 top
D48  87.63,72.71 90 top
D49  16.19,63.5 90 top
D50  28.89,63.5 90 top
D51  41.59,63.5 90 top
D52  54.29,63.5 90 top
D53  66.99,63.5 90 top
D54  79.69,63.5 90 top
D55  19.37,63.5 90 top
D56  32.07,63.5 90 top
D57  44.77,63.5 90 top
D58  57.47,63.5 90 top
D59  70.17,63.5 90 top
D60  82.87,63.5 90 top
D61  22.54,63.5 90 top
D62  35.24,63.5 90 top
D63  47.94,63.5 90 top
D64  60.64,63.5 90 top
D65  73.34,63.5 90 top
D66  86.04,63.5 90 top
D67  25.72,63.5 90 top
D68  38.42,63.5 90 top
D69  51.12,63.5 90 top
D70  63.82,63.5 90 top
D71  76.52,63.5 90 top
D72  89.22,63.5 90 top
D73  23.81,46.99 0 top
D74  23.81,33.02 0 top
D75  23.81,19.05 0 top
D76  32.38,12.06 180 top
D77  32.38,26.04 180 top
D78  32.38,40.01 180 top
D79  74.93,36.2 180 top
H1  4,4 0 top
H2  4,96 0 top
H3  96,96 0 top
H4  96,4 0 top
J1  71.12,2.54 0 top
J1A  15.24,97.79 0 top
J1B  40.64,97.79 0 top
J1C  66.04,97.79 0 top
R1  17.14,38.42 0 top
R2  20.95,49.53 180 top
R3  11.43,49.53 0 top
R4  26.35,41.27 270 top
R5  17.14,24.45 0 top
R6  20.95,35.56 180 top
R7  11.43,35.56 0 top
R8  26.35,27.3 270 top
R9  17.14,10.48 0 top
R10  20.95,21.59 180 top
R11  11.43,21.59 0 top
R12  26.35,13.34 270 top
R13  39.05,20.32 180 top
R14  34.92,9.21 0 top
R15  44.45,9.21 180 top
R16  29.53,17.78 90 top
R17  39.05,33.97 180 top
R18  34.92,23.18 0 top
R19  44.45,23.18 180 top
R20  29.53,31.75 90 top
R21  39.05,48.26 180 top
R22  34.92,37.15 0 top
R23  44.45,37.15 180 top
R24  29.53,45.72 90 top
R25  69.85,42.55 270 top
R26  55.88,48.9 180 top
R27  65.41,48.9 180 top
R28  61.59,42.55 90 top
R29  53.34,42.55 90 top
R30  49.53,29.21 90 top
R31  53.34,15.24 270 top
R32  55.24,36.2 0 top
R33  65.41,36.2 0 top
R34  39.05,53.98 0 top
R35  39.05,51.12 180 top
R36  92.71,16.19 270 top
R37  85.72,16.19 270 top
R38  78.74,16.19 270 top
R39  71.75,16.19 270 top
R40  64.77,16.19 270 top
R41  57.78,16.19 270 top
R42  92.71,26.35 270 top
R43  85.72,26.35 270 top
R44  78.74,26.35 270 top
R45  71.75,26.35 270 top
R46  64.77,26.35 270 top
R47  57.78,26.35 270 top
R48  16.19,81.92 270 top
R49  19.37,81.92 270 top
R50  22.54,81.92 270 top
R51  25.72,81.92 270 top
R52  28.89,81.92 270 top
R53  32.07,81.92 270 top
R54  35.24,81.92 270 top
R55  38.42,81.92 270 top
R56  41.59,81.92 270 top
R57  44.77,81.92 270 top
R58  47.94,81.92 270 top
R59  51.12,81.92 270 top
R60  54.29,81.92 270 top
R61  57.47,81.92 270 top
R62  60.64,81.92 270 top
R63  63.82,81.92 270 top
R64  66.99,81.92 270 top
R65  70.17,81.92 270 top
R66  73.34,81.92 270 top
R67  76.52,81.92 270 top
R68  79.69,81.92 270 top
R69  82.87,81.92 270 top
R70  86.04,81.92 270 top
R71  89.22,81.92 270 top
T1  19.37,43.5 270 top
T2  13.34,43.5 270 top
T3  49.53,55.88 0 top
T4  19.37,29.53 270 top
T5  13.34,29.53 270 top
T6  57.15,55.88 0 top
T7  19.37,15.56 270 top
T8  13.34,15.56 270 top
T9  64.77,55.88 0 top
T10  36.83,15.56 90 top
T11  42.86,15.24 90 top
T12  72.39,55.88 0 top
T13  36.83,29.21 90 top
T14  42.86,29.21 90 top
T15  80.01,55.88 0 top
T16  36.83,43.5 90 top
T17  42.86,43.5 90 top
T18  87.63,55.56 0 top
T19  73.66,41.27 270 top
T20  65.41,41.27 270 top
T21  58.42,41.27 270 top
T22  49.53,16.51 90 top
T23  27.62,53.34 180 top
T24  97.16,14.92 270 top
T25  90.17,14.92 270 top
T26  83.19,14.92 270 top
T27  76.2,14.92 270 top
T28  69.22,14.92 270 top
T29  62.23,14.92 270 top
T30  97.16,22.54 90 top
T31  89.53,22.54 90 top
T32  82.55,22.54 90 top
T33  75.56,22.54 90 top
T34  68.58,22.54 90 top
T35  61.59,22.54 90 top

### Tracks (layer width: path | path; a pad name or v marks a point on that pad's centre or on a via)
BIAS
  Top 0.305: R2.1 24.77,53.02 arc-90 T23.E
  Bottom 0.305: R10.1 R6.1 R2.1 arc-90 26.35,51.12 29.84,51.12 arc-90 31.11,49.85 R22.1 R18.1 R14.1 | C8.2 T23.E
GND  (via drill 0.4)  (9 unrouted)
  Top 0.61: T3.E 52.07,57.15 arc90 51.44,57.78 50.16,57.78 arc-90 49.53,58.42 v49.53,63.5 | T6.E 59.69,57.15 arc90 59.05,57.78 56.52,57.78 arc-90 55.88,58.42 v55.88,63.5 | T9.E 67.31,57.15 arc90 66.67,57.78 66.04,57.78 arc-90 65.41,58.42 v65.41,63.5 | T12.E 74.93,57.47 arc90 74.3,58.1 72.39,58.1 arc-90 71.75,58.74 v71.75,63.5 | T15.E 82.55,57.15 arc90 81.92,57.78 arc-90 81.28,58.42 v81.28,63.5 | T18.E 90.17,57.15 arc90 89.53,57.78 88.27,57.78 arc-90 87.63,58.42 v87.63,63.5
  Bottom 0.61: 11.75,38.42 R1.1 | 11.75,38.42 11.75,26.99 | 11.75,26.99 11.75,24.45 | 11.75,24.45 11.75,13.02 | 11.75,13.02 11.75,10.48 | R13.1 44.45,20.32 | 44.45,20.32 44.45,31.75 | 44.45,31.75 44.45,33.97 | 44.45,33.97 44.45,46.04 | R17.1 44.45,33.97 | 44.45,20.32 44.45,17.78 | 44.45,17.78 44.45,6.67 | T35.E T34.E T33.E T32.E T31.E T30.E | 90.17,63.5 v87.63,63.5 v81.28,63.5 v71.75,63.5 v65.41,63.5 v55.88,63.5 v49.53,63.5 13.02,63.5 | R9.1 11.75,10.48 | T11.E 44.45,17.78 | T14.E 44.45,31.75 | T17.E 44.45,46.04 | R35.1 43.18,51.12 arc-90 44.45,49.85 44.45,48.26 | 44.45,48.26 44.45,46.04 | R21.1 44.45,48.26 | CN1.1 50.8,5.4 arc90 49.53,6.67 44.45,6.67 | 44.45,6.67 13.02,6.67 arc-90 11.75,7.94 11.75,10.48 | T8.E 11.75,13.02 | R5.1 11.75,24.45 | T5.E 11.75,26.99 | C8.1 13.02,53.34 arc90 11.75,52.07 11.75,40.96 | 11.75,38.42 11.75,40.96 | T2.E 11.75,40.96
  pour Bottom (isolate 0.406): 0,74 0,96 arc-90 4,100 32,100 96,100 arc-90 100,96 100,76 100,4 arc-90 96,0 62,0 4,0 arc-90 0,4
N$1
  Bottom 0.305: T3.B arc-90 48.26,54.61 46.35,54.61 arc-90 45.4,55.56 arc90 44.45,56.52 8.89,56.52 arc90 7.62,55.24 R3.1
N$2
  Top 0.305: J1A.1 14.61,97.16 D1.C
N$3
  Top 0.305: R1.2 20.95,39.69 arc90 19.68,40.96 T1.C T2.B
N$4
  Top 0.305: C6.2 33.02,46.99 arc90 31.75,48.26 21.27,48.26 arc90 D73.C 19.05,46.99 arc90 T1.E
N$5
  Top 0.305: D40.C 62.23,66.36 arc90 62.87,65.72 67.94,65.72 arc-90 68.58,65.09 68.58,58.42 arc90 69.22,57.78 arc-90 69.85,57.15 T12.C 69.85,53.98 arc90 71.12,52.7 83.82,52.7 arc-90 85.09,51.44 85.09,33.34 arc-90 83.82,32.07 80.01,32.07 arc90 78.74,30.8 R44.1
  Bottom 0.305: D40.C D39.C D38.C D37.C
N$6
  Top 0.305: J1A.2 D2.C
N$7
  Top 0.305: J1A.3 20.32,95.57 D3.C
N$8
  Top 0.305: J1A.4 22.86,96.2 D4.C
N$9
  Top 0.305: J1A.5 25.4,96.84 D5.C
N$10
  Top 0.305: J1A.6 30.48,95.25 D6.C
N$11
  Top 0.305: J1A.7 33.34,94.93 D7.C
N$12
  Top 0.305: J1A.8 33.97,97.79 D8.C
N$13
  Top 0.305: D9.C 40.64,95.57 J1B.1
N$14
  Top 0.305: D10.C J1B.2
N$15
  Top 0.305: D11.C 46.35,97.16 J1B.3
N$16
  Top 0.305: D12.C 48.26,96.2 J1B.4
N$17
  Top 0.305: D13.C 50.8,96.84 J1B.5
N$18
  Top 0.305: D14.C 53.34,97.47 J1B.6
N$19
  Top 0.305: D15.C 58.74,94.93 J1B.7
N$20
  Top 0.305: J1B.8 59.37,97.79 D16.C
N$21
  Top 0.305: D17.C 66.04,95.57 J1C.1
N$22
  Top 0.305: D18.C J1C.2
N$23
  Top 0.305: D19.C 71.75,97.16 J1C.3
N$24
  Top 0.305: D20.C 73.66,96.2 J1C.4
N$25
  Top 0.305: D21.C 77.79,94.93 76.2,96.52 J1C.5
N$26
  Top 0.305: D22.C 78.74,97.47 J1C.6
N$27
  Top 0.305: J1C.7 84.14,94.93 D23.C
N$28
  Top 0.305: J1C.8 84.77,97.79 D24.C
N$29
  Top 0.305: D1.A 14.61,78.11 | 14.61,78.11 D25.A | D49.A R48.2 14.61,78.11
N$30
  Top 0.305: D17.A 65.41,78.11 | 65.41,78.11 D41.A | D53.A R64.2 65.41,78.11
N$31
  Top 0.305: D2.A 17.78,78.11 | 17.78,78.11 D26.A | D55.A R49.2 17.78,78.11
N$32
  Top 0.305: D3.A 20.95,78.11 | 20.95,78.11 D27.A | D61.A R50.2 20.95,78.11
N$33
  Top 0.305: D4.A 24.13,78.11 | 24.13,78.11 D28.A | D67.A R51.2 24.13,78.11
N$34
  Top 0.305: D5.A 27.3,78.11 | 27.3,78.11 D29.A | D50.A R52.2 27.3,78.11
N$35
  Top 0.305: D6.A 30.48,78.11 | 30.48,78.11 D30.A | D56.A R53.2 30.48,78.11
N$36
  Top 0.305: D7.A 33.66,78.11 | 33.66,78.11 D31.A | D62.A R54.2 33.66,78.11
N$37
  Top 0.305: D8.A 36.83,78.11 | 36.83,78.11 D32.A | D68.A R55.2 36.83,78.11
N$38
  Top 0.305: D9.A 40.01,78.11 | 40.01,78.11 D33.A | D51.A R56.2 40.01,78.11
N$39
  Top 0.305: D10.A 43.18,78.11 | 43.18,78.11 D34.A | D57.A R57.2 43.18,78.11
N$40
  Top 0.305: D11.A 46.35,78.11 | 46.35,78.11 D35.A | D63.A R58.2 46.35,78.11
N$41
  Top 0.305: D12.A 49.53,78.11 | 49.53,78.11 D36.A | D69.A R59.2 49.53,78.11
N$42
  Top 0.305: D13.A 52.7,78.11 | 52.7,78.11 D37.A | D52.A R60.2 52.7,78.11
N$43
  Top 0.305: D14.A 55.88,78.11 | 55.88,78.11 D38.A | D58.A R61.2 55.88,78.11
N$44
  Top 0.305: D15.A 59.05,78.11 | 59.05,78.11 D39.A | D64.A R62.2 59.05,78.11
N$45
  Top 0.305: D16.A 62.23,78.11 | 62.23,78.11 D40.A | D70.A R63.2 62.23,78.11
N$46
  Top 0.305: D18.A 68.58,78.11 | 68.58,78.11 D42.A | D59.A R65.2 68.58,78.11
N$47
  Top 0.305: D19.A 71.75,78.11 | 71.75,78.11 D43.A | D65.A R66.2 71.75,78.11
N$48
  Top 0.305: D20.A 74.93,78.11 | 74.93,78.11 D44.A | D71.A R67.2 74.93,78.11
N$49
  Top 0.305: D21.A 78.11,78.11 | 78.11,78.11 D45.A | D54.A R68.2 78.11,78.11
N$50
  Top 0.305: D22.A 81.28,78.11 | 81.28,78.11 D46.A | D60.A R69.2 81.28,78.11
N$51
  Top 0.305: D23.A 84.45,78.11 | 84.45,78.11 D47.A | D66.A R70.2 84.45,78.11
N$52
  Top 0.305: D24.A 87.63,78.11 | 87.63,78.11 D48.A | D72.A R71.2 87.63,78.11
N$53
  Bottom 0.305: R35.2 R34.1 arc90 34.61,54.61 28.89,54.61 arc90 T23.B
N$54
  Bottom 0.305: T21.C R29.1 53.34,36.2 | T21.C R28.1 | R33.1 arc-90 60.33,34.92 58.42,34.92 arc-90 57.15,36.2 T21.C | 53.34,36.2 53.34,33.66 arc-90 52.7,33.02 R30.2 | R32.1 53.34,36.2
N$55
  Bottom 0.305: R11.1 arc90 9.53,23.5 9.53,53.98 arc-90 10.79,55.24 43.18,55.24 arc-90 44.13,54.29 arc90 45.09,53.34 63.5,53.34 arc90 64.77,54.61 T9.B
N$56
  Top 0.305: D36.C 49.53,65.72 arc90 50.16,65.09 61.59,65.09 arc-90 62.23,64.45 T9.C 62.23,53.34 arc90 63.5,52.07 83.19,52.07 arc-90 84.45,50.8 84.45,33.97 arc-90 83.19,32.7 73.03,32.7 arc90 71.75,31.43 R45.1
  Bottom 0.305: D33.C D34.C D35.C D36.C
N$57
  Bottom 0.305: T21.B 60.64,41.27 arc90 61.59,42.23 61.59,42.55 arc-90 62.87,43.81 T20.C
N$58
  Top 0.305: D44.C 74.93,62.55 arc90 75.56,61.91 77.47,61.91 arc-90 78.11,61.28 78.11,56.52 arc-90 T15.C 77.47,54.61 arc90 78.74,53.34 84.45,53.34 arc-90 85.72,52.07 R43.1
  Bottom 0.305: D44.C D43.C D42.C D41.C
N$59
  Top 0.305: R2.2 R3.2 14.61,49.53 arc90 13.34,48.26 13.34,46.35 | T2.C 13.34,46.35 | T1.B 13.34,46.35
N$60  (via drill 0.4)
  Top 0.305: v13.02,62.23 10.79,62.23 arc90 9.53,60.96 9.53,9.84 14.92,4.45 57.15,4.45 arc-90 58.42,3.17 CN2.1
  Bottom 0.305: 16.19,62.23 28.89,62.23 | 28.89,62.23 D50.C | 28.89,62.23 41.59,62.23 | 41.59,62.23 D51.C | D49.C 16.19,62.23 | 41.59,62.23 54.29,62.23 | 54.29,62.23 66.99,62.23 | 66.99,62.23 78.42,62.23 arc-90 79.69,60.96 D54.C | D52.C 54.29,62.23 | D53.C 66.99,62.23 | 16.19,62.23 v13.02,62.23
N$61  (via drill 0.4)
  Top 0.305: v13.02,60.96 11.43,60.96 arc90 10.16,59.69 10.16,10.16 15.24,5.08 59.68,5.08 arc-90 60.96,3.8 CN2.2
  Bottom 0.305: D55.C 19.37,61.59 | 19.37,61.59 26.99,61.59 arc-90 27.62,60.96 27.62,59.05 arc90 28.26,58.42 29.84,58.42 arc90 30.48,59.05 30.48,60.96 arc-90 31.11,61.59 32.07,61.59 | D56.C 32.07,61.59 | 32.07,61.59 39.69,61.59 arc-90 40.32,60.96 40.32,59.05 arc90 40.96,58.42 42.55,58.42 arc90 43.18,59.05 43.18,60.96 arc-90 43.81,61.59 44.77,61.59 | D57.C 44.77,61.59 | 19.37,61.59 18.41,61.59 arc90 17.78,60.96 17.78,59.69 arc-90 16.51,58.42 15.88,58.42 arc-90 14.92,59.37 14.92,60.01 arc90 13.97,60.96 v13.02,60.96 | 57.47,61.59 65.09,61.59 arc-90 65.72,60.96 65.72,59.05 arc90 66.36,58.42 67.94,58.42 arc90 68.58,59.05 68.58,60.96 arc-90 69.22,61.59 70.17,61.59 | 44.77,61.59 52.39,61.59 arc-90 53.02,60.96 53.02,59.05 arc90 53.66,58.42 55.24,58.42 arc90 55.88,59.05 55.88,60.96 arc-90 56.52,61.59 57.47,61.59 | D58.C 57.47,61.59 | 70.17,61.59 77.79,61.59 arc-90 78.42,60.96 78.42,59.37 arc90 79.38,58.42 81.6,58.42 arc90 D60.C | D59.C 70.17,61.59
N$62  (via drill 0.4)
  Top 0.305: v13.02,59.69 12.06,59.69 arc90 10.79,58.42 10.79,10.48 15.56,5.71 62.22,5.71 arc-90 63.5,4.43 CN2.3
  Bottom 0.305: 22.54,60.96 26.35,60.96 arc-90 26.99,60.33 26.99,58.42 arc90 27.62,57.78 33.02,57.78 arc90 33.66,58.42 33.66,60.33 arc-90 34.29,60.96 35.24,60.96 | D62.C 35.24,60.96 | D61.C 22.54,60.96 | 35.24,60.96 39.18,60.96 arc-90 39.81,60.33 39.81,58.42 arc90 40.45,57.78 45.72,57.78 arc90 46.35,58.42 46.35,60.33 arc-90 46.99,60.96 47.94,60.96 | 47.94,60.96 51.75,60.96 arc-90 52.39,60.33 52.39,58.42 arc90 53.02,57.78 58.42,57.78 arc90 59.05,58.42 59.05,60.33 arc-90 59.69,60.96 60.64,60.96 | D63.C 47.94,60.96 | 60.64,60.96 64.45,60.96 arc-90 65.09,60.33 65.09,58.42 arc90 65.72,57.78 71.12,57.78 arc90 71.75,58.42 71.75,60.33 arc-90 72.39,60.96 73.34,60.96 | D64.C 60.64,60.96 | 73.34,60.96 77.15,60.96 arc-90 77.79,60.33 77.79,58.42 arc90 78.42,57.78 84.77,57.78 arc90 86.04,59.05 D66.C | D65.C 73.34,60.96 | 22.54,60.96 21.59,60.96 arc90 20.95,60.33 20.95,58.74 arc-90 20,57.78 15.56,57.78 arc-90 14.29,59.05 arc90 13.65,59.69 v13.02,59.69
N$63  (via drill 0.4)
  Top 0.305: v13.02,58.42 12.7,58.42 arc90 11.43,57.15 11.43,10.79 15.88,6.35 64.77,6.35 arc-90 66.04,5.08 CN2.4
  Bottom 0.305: 38.42,57.15 25.72,57.15 | D68.C 38.42,57.15 | D67.C 25.72,57.15 | 38.42,57.15 51.12,57.15 | 51.12,57.15 63.82,57.15 | 63.82,57.15 76.52,57.15 | 76.52,57.15 87.95,57.15 arc90 89.22,58.42 D72.C | 51.12,57.15 D69.C | 63.82,57.15 D70.C | 76.52,57.15 D71.C | 25.72,57.15 14.29,57.15 arc-90 v13.02,58.42
N$64
  Top 0.305: C1.1 arc-90 23.81,45.09 R4.1 arc90 27.62,46.35 D73.A
N$65
  Bottom 0.305: R7.1 arc90 8.89,36.83 8.89,54.61 arc-90 10.16,55.88 44.13,55.88 arc-90 44.77,55.24 44.77,54.93 arc90 45.72,53.98 55.88,53.98 arc90 57.15,55.24 T6.B
N$66
  Top 0.305: T5.B T4.C 19.68,26.99 arc-90 20.95,25.72 R5.2
N$67
  Top 0.305: T4.E arc-90 19.05,33.02 D74.C 21.59,33.02 arc90 22.86,34.29 C1.2
N$68
  Bottom 0.305: T20.E R25.2 T19.E
N$69
  Top 0.305: R9.2 20.95,11.75 arc90 19.68,13.02 T7.C T8.B
N$70
  Top 0.305: C2.1 arc-90 23.81,31.11 R8.1 arc90 27.62,32.38 D74.A
N$71
  Top 0.305: C2.2 22.86,20.32 arc-90 21.59,19.05 D75.C 19.05,19.05 arc90 T7.E
N$72
  Bottom 0.305: R19.1 arc-90 46.99,24.45 46.99,49.53 arc-90 49.53,52.07 77.47,52.07 arc90 80.01,54.61 T15.B
N$73
  Top 0.305: R6.2 R7.2 14.61,35.56 arc90 13.34,34.29 T5.C T4.B
N$74
  Top 0.305: D75.A 27.62,18.41 arc-90 R12.1 23.81,17.14 arc90 C3.1
N$75
  Bottom 0.305: R15.1 arc-90 46.35,11.11 46.35,50.16 arc-90 48.9,52.7 69.85,52.7 arc90 72.39,55.24 T12.B
N$76
  Top 0.305: R13.2 36.83,20.32 arc-90 38.1,19.05 T10.C T11.B
N$77
  Top 0.305: R17.2 36.83,33.97 arc-90 38.1,32.7 T13.C T14.B
N$78
  Bottom 0.305: R26.1 R27.2 R28.2 66.04,46.35 arc-90 67.31,45.09 67.31,42.55 arc-90 66.04,41.27 T20.B
N$79
  Top 0.305: C4.1 arc-90 32.07,13.97 R16.1 arc90 28.57,13.02 D76.A
N$80
  Top 0.305: C4.2 33.02,24.77 arc-90 34.29,26.04 D77.C 37.47,26.04 arc90 T13.E
N$81
  Top 0.305: C3.2 22.86,12.06 arc90 24.13,10.79 34.92,10.79 arc90 D76.C 37.15,12.06 arc90 T10.E
N$82
  Top 0.305: R10.2 R11.2 14.61,21.59 arc90 13.34,20.32 T8.C T7.B
N$83
  Top 0.305: R30.1 49.53,22.23 arc-90 48.9,21.59 arc90 47.62,20.32 47.62,17.78 arc90 48.9,16.51 T22.B
N$84
  Top 0.305: C5.1 arc-90 32.07,27.94 R20.1 arc90 28.57,26.99 D77.A
N$85
  Bottom 0.305: T18.B 87.63,53.98 arc-90 85.09,51.44 50.8,51.44 arc90 48.26,48.9 R23.1
N$86
  Top 0.305: R21.2 36.51,48.26 arc-90 38.1,46.67 T16.C T17.B
N$87
  Top 0.305: T16.E arc-90 37.15,40.01 D78.C 34.29,40.01 arc90 33.02,38.73 C5.2
N$88
  Top 0.406: J1.6 83.82,6.35 arc-90 85.09,7.62 94.61,7.62 arc90 95.89,8.89 T24.C
N$89
  Top 0.305: D78.A 28.57,40.96 arc-90 R24.1 32.07,41.91 arc90 C6.1
N$90
  Bottom 0.305: R33.2 D79.A
N$91
  Bottom 0.305: D79.C 78.74,37.47 | 78.74,37.47 C7.2 | 75.56,37.47 60.33,37.47 arc90 R32.2 | 75.56,37.47 78.74,37.47 | T19.B 74.3,41.27 arc-90 75.56,40.01 75.56,37.47
N$92
  Top 0.406: J1.5 81.28,7.62 arc-90 82.55,8.89 87.63,8.89 arc90 88.9,10.16 T25.C
N$93
  Top 0.406: T26.C 81.92,11.43 arc-90 80.64,10.16 80.01,10.16 arc90 78.74,8.89 J1.4
N$94
  Top 0.406: T27.C arc-90 76.2,11.11 J1.3
N$95
  Top 0.406: T28.C 67.94,11.43 arc90 69.22,10.16 72.39,10.16 arc-90 73.66,8.89 J1.2
N$96
  Top 0.406: J1.1 71.12,7.62 arc90 69.85,8.89 62.23,8.89 arc-90 60.96,10.16 T29.C
N$97
  Top 0.305: R36.2 92.71,13.65 arc-90 93.98,14.92 T24.B
N$98
  Top 0.305: R37.2 85.72,13.65 arc-90 87,14.92 T25.B
N$99
  Top 0.305: R38.2 78.74,13.65 arc-90 80.01,14.92 T26.B
N$100
  Top 0.305: R39.2 71.75,13.65 arc-90 73.03,14.92 T27.B
N$101
  Top 0.305: R40.2 64.77,13.65 arc-90 66.04,14.92 T28.B
N$102
  Top 0.305: R41.2 57.78,13.65 arc-90 59.05,14.92 T29.B
N$103
  Top 0.305: R36.1 T30.C
N$104
  Top 0.305: R37.1 T31.C
N$105
  Top 0.305: R38.1 T32.C
N$106
  Top 0.305: R39.1 T33.C
N$107
  Top 0.305: R40.1 T34.C
N$108
  Top 0.305: R41.1 T35.C
N$109
  Top 0.305: D47.C 84.45,56.2 arc90 T18.C arc-90 86.36,54.29 86.36,33.34 arc90 87.63,32.07 91.44,32.07 arc-90 92.71,30.8 R42.1
  Bottom 0.305: D45.C D46.C D47.C D48.C
N$110
  Top 0.305: R42.2 T30.B
N$111
  Top 0.305: R14.2 R15.2 40.64,12.7 | T10.B 39.37,15.56 arc-90 40.64,14.29 40.64,12.7 | T11.C 40.64,12.7
N$112
  Top 0.305: R43.2 T31.B
N$113
  Top 0.305: T13.B 39.37,29.21 arc-90 40.64,27.94 40.64,26.67 | 40.64,26.67 R19.2 R18.2 | T14.C 40.64,26.67
N$114
  Top 0.305: R44.2 T32.B
N$115
  Top 0.305: T16.B 39.37,43.5 arc-90 40.64,42.23 40.64,40.96 | 40.64,40.96 R23.2 R22.2 | T17.C 40.64,40.96
N$116
  Top 0.305: R45.2 T33.B
N$117
  Top 0.305: D32.C 36.83,65.09 arc90 37.47,64.45 52.07,64.45 arc-90 52.7,63.82 52.7,58.74 arc90 53.34,58.1 53.98,58.1 arc-90 54.61,57.47 T6.C 54.61,54.61 arc-90 53.34,53.34 48.26,53.34 arc90 46.99,52.07 46.99,33.02 arc90 48.58,31.43 63.5,31.43 arc-90 R46.1
  Bottom 0.305: D32.C D31.C D30.C D29.C
N$118
  Top 0.305: R46.2 T34.B
N$119
  Top 0.305: D28.C 24.13,64.14 arc90 24.77,63.5 45.72,63.5 arc-90 46.35,62.87 46.35,55.88 | R47.1 47.94,30.16 arc-90 46.35,31.75 46.35,55.88 | T3.C 46.35,55.88
  Bottom 0.305: D28.C D27.C D26.C D25.C
N$120
  Top 0.305: R47.2 T35.B
PWRPULSE
  Top 0.305: R31.1 52.39,19.05 arc90 51.12,17.78 51.12,15.24 arc-90 49.85,13.97 T22.C 46.67,13.97 arc90 45.4,12.7 45.4,8.89 arc-90 44.13,7.62 27.62,7.62 arc-90 26.35,8.89 R12.2
  Bottom 0.305: R12.2 26.35,13.97 arc-90 27.62,15.24 28.26,15.24 arc90 29.53,16.51 R16.2 29.53,22.23 arc90 28.26,23.5 R8.2 26.35,28.26 arc-90 27.62,29.53 28.26,29.53 arc90 29.53,30.8 R20.2 29.53,36.2 arc90 28.26,37.47 R4.2 26.35,42.23 arc-90 27.62,43.5 28.26,43.5 arc90 29.53,44.77 R24.2
VCC  (6 unrouted)
  Top 0.61: R71.1 89.22,88.9 | 89.22,88.9 86.04,88.9 | 86.04,88.9 82.87,88.9 | 82.87,88.9 79.69,88.9 | 79.69,88.9 76.52,88.9 | 76.52,88.9 73.34,88.9 | 73.34,88.9 70.17,88.9 | 70.17,88.9 66.99,88.9 | 66.99,88.9 63.82,88.9 | 63.82,88.9 60.64,88.9 | 60.64,88.9 57.47,88.9 | 57.47,88.9 54.29,88.9 | 54.29,88.9 51.12,88.9 | 51.12,88.9 47.94,88.9 | 47.94,88.9 44.77,88.9 | 44.77,88.9 41.59,88.9 | 41.59,88.9 38.42,88.9 | 38.42,88.9 35.24,88.9 | 35.24,88.9 32.07,88.9 | 32.07,88.9 28.89,88.9 | 28.89,88.9 25.72,88.9 | 25.72,88.9 22.54,88.9 | 22.54,88.9 19.37,88.9 | 19.37,88.9 16.19,88.9 | R48.1 16.19,88.9 | R49.1 19.37,88.9 | R50.1 22.54,88.9 | R51.1 25.72,88.9 | R52.1 28.89,88.9 | R53.1 32.07,88.9 | R54.1 35.24,88.9 | R55.1 38.42,88.9 | R56.1 41.59,88.9 | R57.1 44.77,88.9 | R58.1 47.94,88.9 | R59.1 51.12,88.9 | R60.1 54.29,88.9 | R61.1 57.47,88.9 | R62.1 60.64,88.9 | R63.1 63.82,88.9 | R64.1 66.99,88.9 | R65.1 70.17,88.9 | R66.1 73.34,88.9 | R67.1 76.52,88.9 | R68.1 79.69,88.9 | R69.1 82.87,88.9 | R70.1 86.04,88.9 | R31.2 54.29,11.43 arc90 55.56,12.7 55.56,16.19 arc-90 56.83,17.46 T29.E T28.E T27.E T26.E T25.E T24.E | 89.22,88.9 CN4.2 | 16.19,88.9 CN3.2
  Bottom 0.61: CN1.2 R31.2
  pour Top (isolate 0.406): 0,4 0,96 arc-90 4,100 96,100 arc-90 100,96 100,4 arc-90 96,0 4,0 arc-90

### Text on the board
tPlace: 0 | 8 | 16 | VCC | VCC | GND | GND | GND | VCC | HexOut | Digit | 0 | 1 | 2 | 3 | 1 | 2 | 3 | 4 | 5 | 6